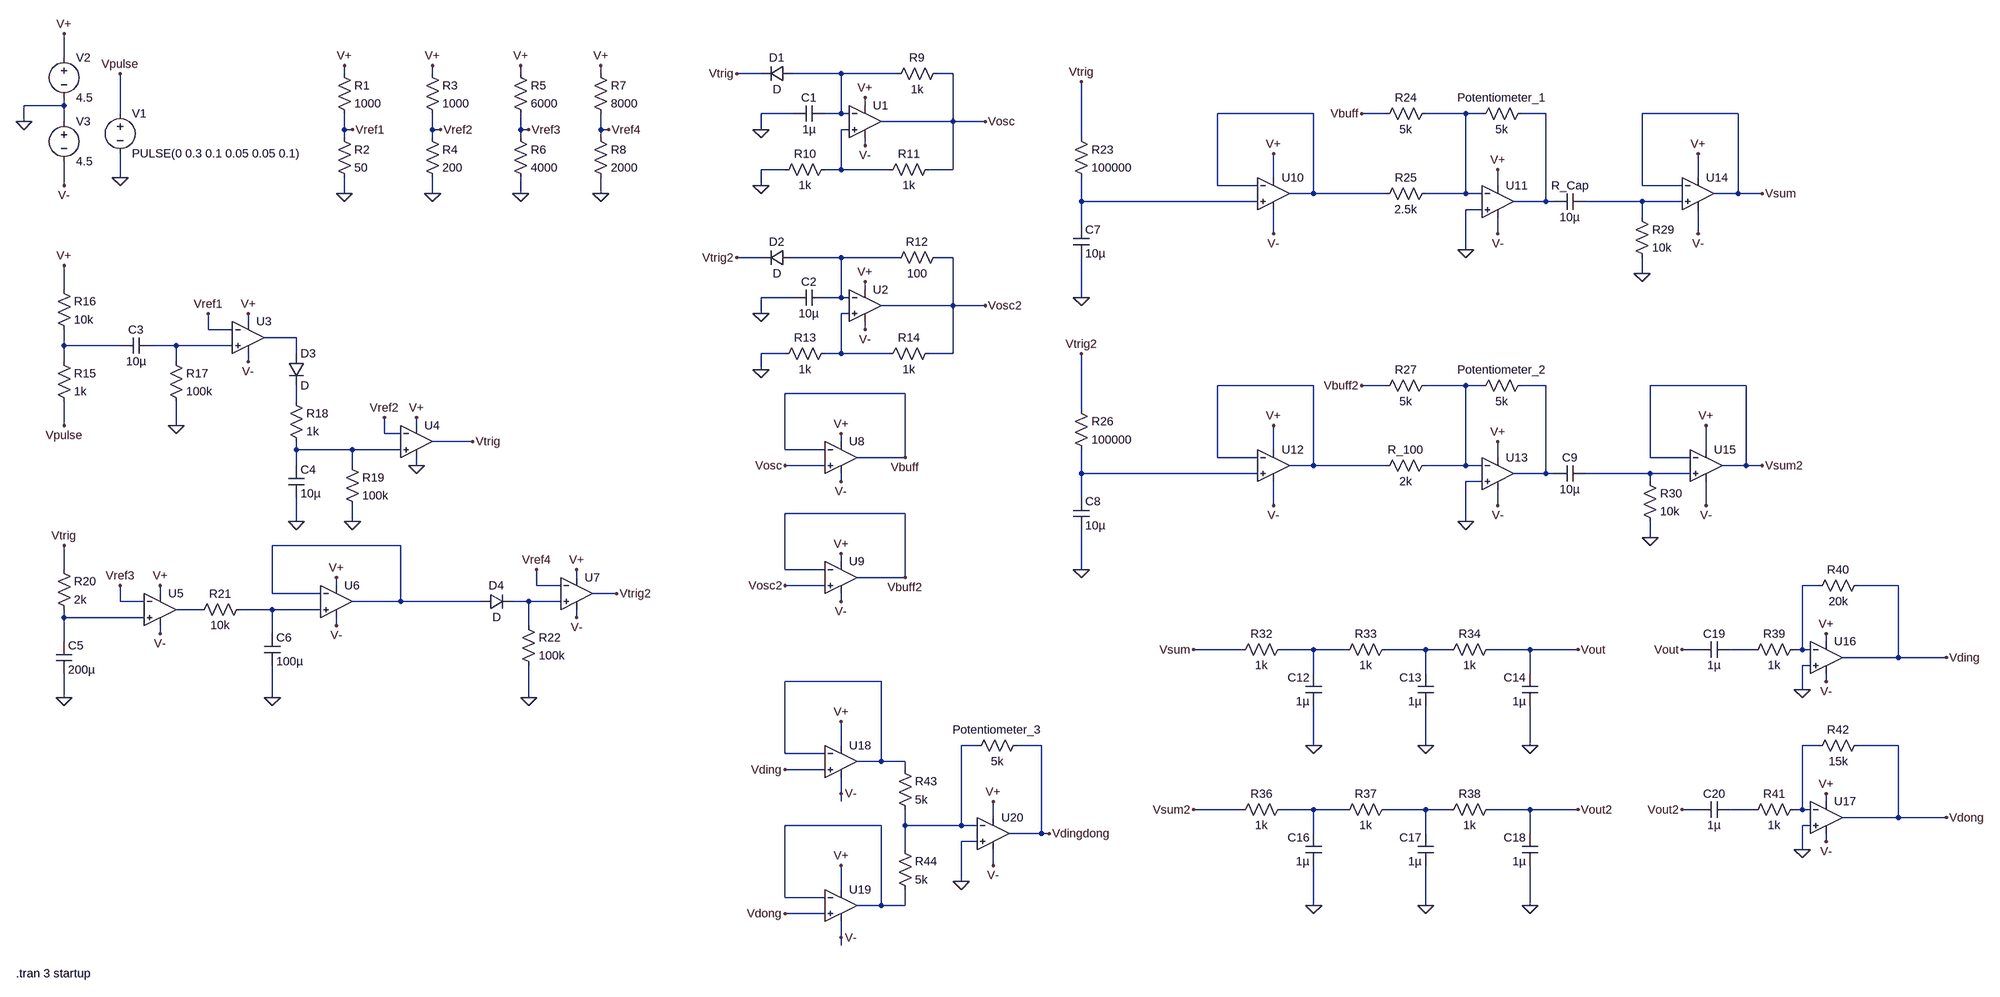
[diagram p0: schematic Project 3 2001.asc]
Project 3 2001.asc, the LTspice schematic file:
Version 4
SHEET 1 3848 1864
WIRE -352 16 -352 -32
WIRE 208 48 208 32
WIRE 384 48 384 32
WIRE 560 48 560 32
WIRE 720 48 720 32
WIRE 1360 48 1312 48
WIRE 1520 48 1424 48
WIRE 1632 48 1520 48
WIRE 1744 48 1712 48
WIRE -352 112 -352 96
WIRE -352 112 -432 112
WIRE 1568 112 1568 96
WIRE -240 128 -240 48
WIRE 1424 128 1360 128
WIRE 1520 128 1520 48
WIRE 1520 128 1488 128
WIRE 1536 128 1520 128
WIRE 2464 128 2272 128
WIRE 2608 128 2560 128
WIRE 2768 128 2688 128
WIRE 2800 128 2768 128
WIRE 2928 128 2880 128
WIRE 3312 128 3120 128
WIRE -432 144 -432 112
WIRE -352 144 -352 112
WIRE 1744 144 1744 48
WIRE 1744 144 1600 144
WIRE 1808 144 1744 144
WIRE 208 160 208 128
WIRE 224 160 208 160
WIRE 384 160 384 128
WIRE 400 160 384 160
WIRE 560 160 560 128
WIRE 576 160 560 160
WIRE 720 160 720 128
WIRE 736 160 720 160
WIRE 1360 160 1360 128
WIRE 1536 160 1520 160
WIRE 208 176 208 160
WIRE 384 176 384 160
WIRE 560 176 560 160
WIRE 720 176 720 160
WIRE 2000 176 2000 64
WIRE 1568 192 1568 176
WIRE 1408 240 1360 240
WIRE 1520 240 1520 160
WIRE 1520 240 1488 240
WIRE 1616 240 1520 240
WIRE 1744 240 1744 144
WIRE 1744 240 1696 240
WIRE -240 256 -240 208
WIRE 2384 256 2384 208
WIRE 3232 256 3232 208
WIRE -352 272 -352 224
WIRE 1360 272 1360 240
WIRE 2272 272 2272 128
WIRE 2352 272 2272 272
WIRE 2832 272 2832 240
WIRE 3120 272 3120 128
WIRE 3200 272 3120 272
WIRE 208 288 208 256
WIRE 384 288 384 256
WIRE 560 288 560 256
WIRE 720 288 720 256
WIRE 2464 288 2464 128
WIRE 2464 288 2416 288
WIRE 2608 288 2464 288
WIRE 2768 288 2768 128
WIRE 2768 288 2688 288
WIRE 2800 288 2768 288
WIRE 3312 288 3312 128
WIRE 3312 288 3264 288
WIRE 3360 288 3312 288
WIRE 2000 304 2000 256
WIRE 2352 304 2000 304
WIRE 2928 304 2928 128
WIRE 2928 304 2864 304
WIRE 2944 304 2928 304
WIRE 3120 304 3008 304
WIRE 3200 304 3120 304
WIRE 2800 320 2768 320
WIRE 3120 336 3120 304
WIRE 2000 352 2000 304
WIRE 2384 368 2384 320
WIRE 2832 368 2832 336
WIRE 3232 368 3232 320
WIRE 2768 400 2768 320
WIRE 1360 416 1312 416
WIRE 1520 416 1424 416
WIRE 1632 416 1520 416
WIRE 1744 416 1712 416
WIRE 3120 448 3120 416
WIRE -352 480 -352 432
WIRE 1568 480 1568 464
WIRE 1424 496 1360 496
WIRE 1520 496 1520 416
WIRE 1520 496 1488 496
WIRE 1536 496 1520 496
WIRE 2000 496 2000 416
WIRE 1744 512 1744 416
WIRE 1744 512 1600 512
WIRE 1808 512 1744 512
WIRE 1360 528 1360 496
WIRE 1536 528 1520 528
WIRE 16 544 16 528
WIRE -64 560 -64 528
WIRE -16 560 -64 560
WIRE 1568 560 1568 544
WIRE 112 576 48 576
WIRE -352 592 -352 560
WIRE -240 592 -352 592
WIRE -128 592 -176 592
WIRE -16 592 -128 592
WIRE 112 608 112 576
WIRE 1408 608 1360 608
WIRE 1520 608 1520 528
WIRE 1520 608 1488 608
WIRE 1616 608 1520 608
WIRE 1744 608 1744 512
WIRE 1744 608 1696 608
WIRE -352 624 -352 592
WIRE -128 624 -128 592
WIRE 16 624 16 608
WIRE 1360 640 1360 608
WIRE 2464 672 2272 672
WIRE 2608 672 2560 672
WIRE 2768 672 2688 672
WIRE 2800 672 2768 672
WIRE 2928 672 2880 672
WIRE 3328 672 3136 672
WIRE 1648 688 1408 688
WIRE 112 704 112 672
WIRE 2000 720 2000 608
WIRE -352 752 -352 704
WIRE -128 752 -128 704
WIRE 352 752 352 736
WIRE 288 768 288 736
WIRE 320 768 288 768
WIRE 464 784 384 784
WIRE 1520 784 1520 768
WIRE 112 800 112 784
WIRE 224 800 112 800
WIRE 320 800 224 800
WIRE 1408 800 1408 688
WIRE 1488 800 1408 800
WIRE 2384 800 2384 752
WIRE 3248 800 3248 752
WIRE 1648 816 1648 688
WIRE 1648 816 1552 816
WIRE 2272 816 2272 672
WIRE 2352 816 2272 816
WIRE 2832 816 2832 784
WIRE 3136 816 3136 672
WIRE 3216 816 3136 816
WIRE 112 832 112 800
WIRE 224 832 224 800
WIRE 352 832 352 816
WIRE 1488 832 1408 832
WIRE 2464 832 2464 672
WIRE 2464 832 2416 832
WIRE 2608 832 2464 832
WIRE 2768 832 2768 672
WIRE 2768 832 2688 832
WIRE 2800 832 2768 832
WIRE 3328 832 3328 672
WIRE 3328 832 3280 832
WIRE 3360 832 3328 832
WIRE 2000 848 2000 800
WIRE 2352 848 2000 848
WIRE 2928 848 2928 672
WIRE 2928 848 2864 848
WIRE 2944 848 2928 848
WIRE 3136 848 3008 848
WIRE 3216 848 3136 848
WIRE 1520 864 1520 848
WIRE 2800 864 2768 864
WIRE 3136 864 3136 848
WIRE 2000 896 2000 848
WIRE 2384 912 2384 864
WIRE 2832 912 2832 880
WIRE 3248 912 3248 864
WIRE 1648 928 1408 928
WIRE 112 944 112 896
WIRE 224 944 224 912
WIRE 2768 944 2768 864
WIRE 3136 976 3136 944
WIRE 320 992 64 992
WIRE 1520 1024 1520 1008
WIRE -352 1040 -352 992
WIRE 1408 1040 1408 928
WIRE 1488 1040 1408 1040
WIRE 2000 1040 2000 960
WIRE 672 1056 672 1040
WIRE 1648 1056 1648 928
WIRE 1648 1056 1552 1056
WIRE 192 1072 192 1056
WIRE 592 1072 592 1040
WIRE 640 1072 592 1072
WIRE 1488 1072 1408 1072
WIRE 3472 1072 3440 1072
WIRE 3632 1072 3552 1072
WIRE -160 1088 -160 1072
WIRE 64 1088 64 992
WIRE 160 1088 64 1088
WIRE 752 1088 704 1088
WIRE -240 1104 -240 1072
WIRE -192 1104 -240 1104
WIRE 320 1104 320 992
WIRE 320 1104 224 1104
WIRE 480 1104 320 1104
WIRE 576 1104 544 1104
WIRE 640 1104 576 1104
WIRE 1520 1104 1520 1088
WIRE -80 1120 -128 1120
WIRE 64 1120 0 1120
WIRE 160 1120 64 1120
WIRE -352 1136 -352 1120
WIRE -192 1136 -352 1136
WIRE 672 1136 672 1120
WIRE 192 1152 192 1136
WIRE 576 1152 576 1104
WIRE -160 1168 -160 1152
WIRE 64 1168 64 1120
WIRE -352 1184 -352 1136
WIRE 3488 1184 3488 1168
WIRE 2320 1200 2224 1200
WIRE 2464 1200 2400 1200
WIRE 2528 1200 2464 1200
WIRE 2688 1200 2608 1200
WIRE 2736 1200 2688 1200
WIRE 2896 1200 2816 1200
WIRE 2992 1200 2896 1200
WIRE 3232 1200 3200 1200
WIRE 3344 1200 3296 1200
WIRE 3440 1200 3440 1072
WIRE 3440 1200 3424 1200
WIRE 3456 1200 3440 1200
WIRE 3632 1216 3632 1072
WIRE 3632 1216 3520 1216
WIRE 3728 1216 3632 1216
WIRE 3456 1232 3440 1232
WIRE 2464 1248 2464 1200
WIRE 2688 1248 2688 1200
WIRE 2896 1248 2896 1200
WIRE 1600 1264 1408 1264
WIRE 3488 1264 3488 1248
WIRE 3440 1280 3440 1232
WIRE -352 1296 -352 1248
WIRE 64 1296 64 1232
WIRE 576 1296 576 1232
WIRE 1520 1392 1520 1344
WIRE 1792 1392 1760 1392
WIRE 1920 1392 1872 1392
WIRE 2464 1392 2464 1312
WIRE 2688 1392 2688 1312
WIRE 2896 1392 2896 1312
WIRE 3472 1392 3440 1392
WIRE 3632 1392 3552 1392
WIRE 1408 1408 1408 1264
WIRE 1488 1408 1408 1408
WIRE 1600 1424 1600 1264
WIRE 1600 1424 1552 1424
WIRE 1648 1424 1600 1424
WIRE 1488 1440 1408 1440
WIRE 1648 1440 1648 1424
WIRE 1520 1488 1520 1456
WIRE 1520 1504 1520 1488
WIRE 3488 1504 3488 1488
WIRE 2320 1520 2224 1520
WIRE 2464 1520 2400 1520
WIRE 2528 1520 2464 1520
WIRE 2688 1520 2608 1520
WIRE 2736 1520 2688 1520
WIRE 2896 1520 2816 1520
WIRE 2992 1520 2896 1520
WIRE 3232 1520 3200 1520
WIRE 3344 1520 3296 1520
WIRE 3440 1520 3440 1392
WIRE 3440 1520 3424 1520
WIRE 3456 1520 3440 1520
WIRE 1824 1536 1824 1504
WIRE 3632 1536 3632 1392
WIRE 3632 1536 3520 1536
WIRE 3728 1536 3632 1536
WIRE 1600 1552 1408 1552
WIRE 1648 1552 1648 1520
WIRE 1760 1552 1760 1392
WIRE 1760 1552 1648 1552
WIRE 1792 1552 1760 1552
WIRE 3456 1552 3440 1552
WIRE 1920 1568 1920 1392
WIRE 1920 1568 1856 1568
WIRE 1936 1568 1920 1568
WIRE 2464 1568 2464 1520
WIRE 2688 1568 2688 1520
WIRE 2896 1568 2896 1520
WIRE 1792 1584 1760 1584
WIRE 3488 1584 3488 1568
WIRE 1648 1600 1648 1552
WIRE 3440 1600 3440 1552
WIRE 1824 1632 1824 1600
WIRE 1760 1664 1760 1584
WIRE 1520 1680 1520 1632
WIRE 1408 1696 1408 1552
WIRE 1488 1696 1408 1696
WIRE 1600 1712 1600 1552
WIRE 1600 1712 1552 1712
WIRE 1648 1712 1648 1680
WIRE 1648 1712 1600 1712
WIRE 2464 1712 2464 1632
WIRE 2688 1712 2688 1632
WIRE 2896 1712 2896 1632
WIRE 1488 1728 1408 1728
WIRE 1520 1776 1520 1744
WIRE 1520 1792 1520 1776
FLAG -240 256 0
FLAG -240 48 Vpulse
FLAG -432 144 0
FLAG -352 -32 V+
FLAG -352 272 V-
FLAG 208 288 0
FLAG 384 288 0
FLAG 560 288 0
FLAG 720 288 0
FLAG 224 160 Vref1
FLAG 400 160 Vref2
FLAG 576 160 Vref3
FLAG 736 160 Vref4
FLAG 208 32 V+
FLAG 384 32 V+
FLAG 560 32 V+
FLAG 720 32 V+
FLAG 1360 160 0
FLAG 1360 272 0
FLAG 1568 96 V+
FLAG 1568 192 V-
FLAG 1312 48 Vtrig
FLAG 1808 144 Vosc
FLAG 1360 528 0
FLAG 1360 640 0
FLAG 1568 464 V+
FLAG 1568 560 V-
FLAG 1312 416 Vtrig2
FLAG 1808 512 Vosc2
FLAG -352 432 V+
FLAG -352 752 Vpulse
FLAG -128 752 0
FLAG -64 528 Vref1
FLAG 16 528 V+
FLAG 16 624 V-
FLAG 112 944 0
FLAG 224 944 0
FLAG 288 736 Vref2
FLAG 352 736 V+
FLAG 464 784 Vtrig
FLAG -352 1296 0
FLAG -352 992 Vtrig
FLAG -240 1072 Vref3
FLAG -160 1072 V+
FLAG -160 1168 V-
FLAG 64 1296 0
FLAG 192 1056 V+
FLAG 192 1152 V-
FLAG 592 1040 Vref4
FLAG 672 1040 V+
FLAG 672 1136 V-
FLAG 576 1296 0
FLAG 752 1088 Vtrig2
FLAG 1520 768 V+
FLAG 1520 864 V-
FLAG 1520 1008 V+
FLAG 1520 1104 V-
FLAG 1408 1072 Vosc2
FLAG 1408 832 Vosc
FLAG 1648 816 Vbuff
FLAG 1648 1056 Vbuff2
FLAG 2000 496 0
FLAG 2384 208 V+
FLAG 2384 368 V-
FLAG 2768 400 0
FLAG 2832 240 V+
FLAG 2832 368 V-
FLAG 3360 288 Vsum
FLAG 2560 128 Vbuff
FLAG 2000 64 Vtrig
FLAG 2000 1040 0
FLAG 2384 752 V+
FLAG 2384 912 V-
FLAG 2768 944 0
FLAG 2832 784 V+
FLAG 2832 912 V-
FLAG 3360 832 Vsum2
FLAG 2560 672 Vbuff2
FLAG 2000 608 Vtrig2
FLAG 3120 448 0
FLAG 3136 976 0
FLAG 3232 208 V+
FLAG 3232 368 V-
FLAG 3248 752 V+
FLAG 3248 912 V-
FLAG 2464 1392 0
FLAG 2688 1392 0
FLAG 2896 1392 0
FLAG 2224 1200 Vsum
FLAG 2992 1200 Vout
FLAG 2464 1712 0
FLAG 2688 1712 0
FLAG 2896 1712 0
FLAG 2224 1520 Vsum2
FLAG 2992 1520 Vout2
FLAG 3488 1168 V+
FLAG 3488 1264 V-
FLAG 3440 1280 0
FLAG 3488 1488 V+
FLAG 3488 1584 V-
FLAG 3440 1600 0
FLAG 3200 1200 Vout
FLAG 3200 1520 Vout2
FLAG 3728 1216 Vding
FLAG 3728 1536 Vdong
FLAG 1520 1344 V+
FLAG 1520 1488 V-
FLAG 1520 1632 V+
FLAG 1520 1776 V-
FLAG 1936 1568 Vdingdong
FLAG 1408 1440 Vding
FLAG 1408 1728 Vdong
FLAG 352 832 0
FLAG 1760 1664 0
FLAG 1824 1504 V+
FLAG 1824 1632 V-
SYMBOL voltage -240 112 R0
WINDOW 123 0 0 Left 0
WINDOW 39 0 0 Left 0
SYMATTR InstName V1
SYMATTR Value PULSE(0 0.3 0.1 0.05 0.05 0.1)
SYMBOL voltage -352 0 R0
WINDOW 123 0 0 Left 0
WINDOW 39 0 0 Left 0
SYMATTR InstName V2
SYMATTR Value 4.5
SYMBOL voltage -352 128 R0
WINDOW 123 0 0 Left 0
WINDOW 39 0 0 Left 0
SYMATTR InstName V3
SYMATTR Value 4.5
SYMBOL res 192 32 R0
SYMATTR InstName R1
SYMATTR Value 1000
SYMBOL res 192 160 R0
SYMATTR InstName R2
SYMATTR Value 50
SYMBOL res 368 32 R0
SYMATTR InstName R3
SYMATTR Value 1000
SYMBOL res 368 160 R0
SYMATTR InstName R4
SYMATTR Value 200
SYMBOL res 544 32 R0
SYMATTR InstName R5
SYMATTR Value 6000
SYMBOL res 544 160 R0
SYMATTR InstName R6
SYMATTR Value 4000
SYMBOL res 704 32 R0
SYMATTR InstName R7
SYMATTR Value 8000
SYMBOL res 704 160 R0
SYMATTR InstName R8
SYMATTR Value 2000
SYMBOL res 1728 32 R90
WINDOW 0 0 56 VBottom 2
WINDOW 3 32 56 VTop 2
SYMATTR InstName R9
SYMATTR Value 1k
SYMBOL res 1504 224 R90
WINDOW 0 0 56 VBottom 2
WINDOW 3 32 56 VTop 2
SYMATTR InstName R10
SYMATTR Value 1k
SYMBOL res 1712 224 R90
WINDOW 0 0 56 VBottom 2
WINDOW 3 32 56 VTop 2
SYMATTR InstName R11
SYMATTR Value 1k
SYMBOL OpAmps\\UniversalOpAmp2 1568 144 R0
SYMATTR InstName U1
SYMBOL cap 1488 112 R90
WINDOW 0 0 32 VBottom 2
WINDOW 3 32 32 VTop 2
SYMATTR InstName C1
SYMATTR Value 1µ
SYMBOL diode 1424 32 R90
WINDOW 0 0 32 VBottom 2
WINDOW 3 32 32 VTop 2
SYMATTR InstName D1
SYMBOL res 1728 400 R90
WINDOW 0 0 56 VBottom 2
WINDOW 3 32 56 VTop 2
SYMATTR InstName R12
SYMATTR Value 100
SYMBOL res 1504 592 R90
WINDOW 0 0 56 VBottom 2
WINDOW 3 32 56 VTop 2
SYMATTR InstName R13
SYMATTR Value 1k
SYMBOL res 1712 592 R90
WINDOW 0 0 56 VBottom 2
WINDOW 3 32 56 VTop 2
SYMATTR InstName R14
SYMATTR Value 1k
SYMBOL OpAmps\\UniversalOpAmp2 1568 512 R0
SYMATTR InstName U2
SYMBOL cap 1488 480 R90
WINDOW 0 0 32 VBottom 2
WINDOW 3 32 32 VTop 2
SYMATTR InstName C2
SYMATTR Value 10µ
SYMBOL diode 1424 400 R90
WINDOW 0 0 32 VBottom 2
WINDOW 3 32 32 VTop 2
SYMATTR InstName D2
SYMBOL res -368 608 R0
SYMATTR InstName R15
SYMATTR Value 1k
SYMBOL res -368 464 R0
SYMATTR InstName R16
SYMATTR Value 10k
SYMBOL cap -176 576 R90
WINDOW 0 0 32 VBottom 2
WINDOW 3 32 32 VTop 2
SYMATTR InstName C3
SYMATTR Value 10µ
SYMBOL res -144 608 R0
SYMATTR InstName R17
SYMATTR Value 100k
SYMBOL OpAmps\\UniversalOpAmp2 16 576 R0
SYMATTR InstName U3
SYMBOL diode 96 608 R0
SYMATTR InstName D3
SYMBOL res 96 688 R0
SYMATTR InstName R18
SYMATTR Value 1k
SYMBOL cap 96 832 R0
SYMATTR InstName C4
SYMATTR Value 10µ
SYMBOL res 208 816 R0
SYMATTR InstName R19
SYMATTR Value 100k
SYMBOL OpAmps\\UniversalOpAmp2 352 784 R0
SYMATTR InstName U4
SYMBOL res -368 1024 R0
SYMATTR InstName R20
SYMATTR Value 2k
SYMBOL cap -368 1184 R0
SYMATTR InstName C5
SYMATTR Value 200µ
SYMBOL OpAmps\\UniversalOpAmp2 -160 1120 R0
SYMATTR InstName U5
SYMBOL res 16 1104 R90
WINDOW 0 0 56 VBottom 2
WINDOW 3 32 56 VTop 2
SYMATTR InstName R21
SYMATTR Value 10k
SYMBOL cap 48 1168 R0
SYMATTR InstName C6
SYMATTR Value 100µ
SYMBOL OpAmps\\UniversalOpAmp2 192 1104 R0
SYMATTR InstName U6
SYMBOL diode 480 1120 R270
WINDOW 0 32 32 VTop 2
WINDOW 3 0 32 VBottom 2
SYMATTR InstName D4
SYMBOL OpAmps\\UniversalOpAmp2 672 1088 R0
SYMATTR InstName U7
SYMBOL res 560 1136 R0
SYMATTR InstName R22
SYMATTR Value 100k
SYMBOL OpAmps\\UniversalOpAmp2 1520 816 R0
SYMATTR InstName U8
SYMBOL OpAmps\\UniversalOpAmp2 1520 1056 R0
SYMATTR InstName U9
SYMBOL res 1984 160 R0
SYMATTR InstName R23
SYMATTR Value 100000
SYMBOL cap 1984 352 R0
SYMATTR InstName C7
SYMATTR Value 10µ
SYMBOL OpAmps\\UniversalOpAmp2 2384 288 R0
SYMATTR InstName U10
SYMBOL OpAmps\\UniversalOpAmp2 2832 304 R0
SYMATTR InstName U11
SYMBOL res 2704 112 R90
WINDOW 0 0 56 VBottom 2
WINDOW 3 32 56 VTop 2
SYMATTR InstName R24
SYMATTR Value 5k
SYMBOL res 2704 272 R90
WINDOW 0 0 56 VBottom 2
WINDOW 3 32 56 VTop 2
SYMATTR InstName R25
SYMATTR Value 2.5k
SYMBOL res 2896 112 R90
WINDOW 0 0 56 VBottom 2
WINDOW 3 32 56 VTop 2
SYMATTR InstName Potentiometer_1
SYMATTR Value 5k
SYMBOL res 1984 704 R0
SYMATTR InstName R26
SYMATTR Value 100000
SYMBOL cap 1984 896 R0
SYMATTR InstName C8
SYMATTR Value 10µ
SYMBOL OpAmps\\UniversalOpAmp2 2384 832 R0
SYMATTR InstName U12
SYMBOL OpAmps\\UniversalOpAmp2 2832 848 R0
SYMATTR InstName U13
SYMBOL res 2704 656 R90
WINDOW 0 0 56 VBottom 2
WINDOW 3 32 56 VTop 2
SYMATTR InstName R27
SYMATTR Value 5k
SYMBOL res 2704 816 R90
WINDOW 0 0 56 VBottom 2
WINDOW 3 32 56 VTop 2
SYMATTR InstName R_100
SYMATTR Value 2k
SYMBOL res 2896 656 R90
WINDOW 0 0 56 VBottom 2
WINDOW 3 32 56 VTop 2
SYMATTR InstName Potentiometer_2
SYMATTR Value 5k
SYMBOL cap 3008 832 R90
WINDOW 0 0 32 VBottom 2
WINDOW 3 32 32 VTop 2
SYMATTR InstName C9
SYMATTR Value 10µ
SYMBOL cap 3008 288 R90
WINDOW 0 0 32 VBottom 2
WINDOW 3 32 32 VTop 2
SYMATTR InstName R_Cap
SYMATTR Value 10µ
SYMBOL res 3104 320 R0
SYMATTR InstName R29
SYMATTR Value 10k
SYMBOL res 3120 848 R0
SYMATTR InstName R30
SYMATTR Value 10k
SYMBOL OpAmps\\UniversalOpAmp2 3232 288 R0
SYMATTR InstName U14
SYMBOL OpAmps\\UniversalOpAmp2 3248 832 R0
SYMATTR InstName U15
SYMBOL cap 2480 1312 R180
WINDOW 0 24 56 Left 2
WINDOW 3 24 8 Left 2
SYMATTR InstName C12
SYMATTR Value 1µ
SYMBOL cap 2704 1312 R180
WINDOW 0 24 56 Left 2
WINDOW 3 24 8 Left 2
SYMATTR InstName C13
SYMATTR Value 1µ
SYMBOL cap 2912 1312 R180
WINDOW 0 24 56 Left 2
WINDOW 3 24 8 Left 2
SYMATTR InstName C14
SYMATTR Value 1µ
SYMBOL res 2416 1184 R90
WINDOW 0 0 56 VBottom 2
WINDOW 3 32 56 VTop 2
SYMATTR InstName R32
SYMATTR Value 1k
SYMBOL res 2624 1184 R90
WINDOW 0 0 56 VBottom 2
WINDOW 3 32 56 VTop 2
SYMATTR InstName R33
SYMATTR Value 1k
SYMBOL res 2832 1184 R90
WINDOW 0 0 56 VBottom 2
WINDOW 3 32 56 VTop 2
SYMATTR InstName R34
SYMATTR Value 1k
SYMBOL cap 2480 1632 R180
WINDOW 0 24 56 Left 2
WINDOW 3 24 8 Left 2
SYMATTR InstName C16
SYMATTR Value 1µ
SYMBOL cap 2704 1632 R180
WINDOW 0 24 56 Left 2
WINDOW 3 24 8 Left 2
SYMATTR InstName C17
SYMATTR Value 1µ
SYMBOL cap 2912 1632 R180
WINDOW 0 24 56 Left 2
WINDOW 3 24 8 Left 2
SYMATTR InstName C18
SYMATTR Value 1µ
SYMBOL res 2416 1504 R90
WINDOW 0 0 56 VBottom 2
WINDOW 3 32 56 VTop 2
SYMATTR InstName R36
SYMATTR Value 1k
SYMBOL res 2624 1504 R90
WINDOW 0 0 56 VBottom 2
WINDOW 3 32 56 VTop 2
SYMATTR InstName R37
SYMATTR Value 1k
SYMBOL res 2832 1504 R90
WINDOW 0 0 56 VBottom 2
WINDOW 3 32 56 VTop 2
SYMATTR InstName R38
SYMATTR Value 1k
SYMBOL res 3440 1184 R90
WINDOW 0 0 56 VBottom 2
WINDOW 3 32 56 VTop 2
SYMATTR InstName R39
SYMATTR Value 1k
SYMBOL res 3568 1056 R90
WINDOW 0 0 56 VBottom 2
WINDOW 3 32 56 VTop 2
SYMATTR InstName R40
SYMATTR Value 20k
SYMBOL cap 3296 1184 R90
WINDOW 0 0 32 VBottom 2
WINDOW 3 32 32 VTop 2
SYMATTR InstName C19
SYMATTR Value 1µ
SYMBOL OpAmps\\UniversalOpAmp2 3488 1216 R0
SYMATTR InstName U16
SYMBOL res 3440 1504 R90
WINDOW 0 0 56 VBottom 2
WINDOW 3 32 56 VTop 2
SYMATTR InstName R41
SYMATTR Value 1k
SYMBOL res 3568 1376 R90
WINDOW 0 0 56 VBottom 2
WINDOW 3 32 56 VTop 2
SYMATTR InstName R42
SYMATTR Value 15k
SYMBOL cap 3296 1504 R90
WINDOW 0 0 32 VBottom 2
WINDOW 3 32 32 VTop 2
SYMATTR InstName C20
SYMATTR Value 1µ
SYMBOL OpAmps\\UniversalOpAmp2 3488 1536 R0
SYMATTR InstName U17
SYMBOL OpAmps\\UniversalOpAmp2 1520 1424 R0
SYMATTR InstName U18
SYMBOL OpAmps\\UniversalOpAmp2 1520 1712 R0
SYMATTR InstName U19
SYMBOL res 1632 1424 R0
SYMATTR InstName R43
SYMATTR Value 5k
SYMBOL res 1632 1584 R0
SYMATTR InstName R44
SYMATTR Value 5k
SYMBOL OpAmps\\UniversalOpAmp2 1824 1568 R0
SYMATTR InstName U20
SYMBOL res 1888 1376 R90
WINDOW 0 0 56 VBottom 2
WINDOW 3 32 56 VTop 2
SYMATTR InstName Potentiometer_3
SYMATTR Value 5k
TEXT -448 1848 Left 2 !.tran 3 startup

The netlist it stands for:
* Project 3 2001.asc
V1 Vpulse 0 PULSE(0 0.3 0.1 0.05 0.05 0.1)
V2 V+ 0 4.5
V3 0 V- 4.5
R1 V+ Vref1 1000
R2 Vref1 0 50
R3 V+ Vref2 1000
R4 Vref2 0 200
R5 V+ Vref3 6000
R6 Vref3 0 4000
R7 V+ Vref4 8000
R8 Vref4 0 2000
R9 Vosc N001 1k
R10 N005 0 1k
R11 Vosc N005 1k
XU1 N005 N001 V+ V- Vosc level2 Avol=1Meg GBW=10Meg Slew=10Meg Ilimit=25m Rail=0 Vos=0 En=0 Enk=0 In=0 Ink=0 Rin=500Meg  ; pins In+ In- V+ V- OUT
C1 N001 0 1µ
D1 N001 Vtrig D
R12 Vosc2 N008 100
R13 N009 0 1k
R14 Vosc2 N009 1k
XU2 N009 N008 V+ V- Vosc2 level2 Avol=1Meg GBW=10Meg Slew=10Meg Ilimit=25m Rail=0 Vos=0 En=0 Enk=0 In=0 Ink=0 Rin=500Meg  ; pins In+ In- V+ V- OUT
C2 N008 0 10µ
D2 N008 Vtrig2 D
R15 N011 Vpulse 1k
R16 V+ N011 10k
C3 N012 N011 10µ
R17 N012 0 100k
XU3 N012 Vref1 V+ V- N010 level2 Avol=1Meg GBW=10Meg Slew=10Meg Ilimit=25m Rail=0 Vos=0 En=0 Enk=0 In=0 Ink=0 Rin=500Meg  ; pins In+ In- V+ V- OUT
D3 N010 N016 D
R18 N016 N017 1k
C4 N017 0 10µ
R19 N017 0 100k
XU4 N017 Vref2 V+ 0 Vtrig level2 Avol=1Meg GBW=10Meg Slew=10Meg Ilimit=25m Rail=0 Vos=0 En=0 Enk=0 In=0 Ink=0 Rin=500Meg  ; pins In+ In- V+ V- OUT
R20 Vtrig N025 2k
C5 N025 0 200µ
XU5 N025 Vref3 V+ V- N023 level2 Avol=1Meg GBW=10Meg Slew=10Meg Ilimit=25m Rail=0 Vos=0 En=0 Enk=0 In=0 Ink=0 Rin=500Meg  ; pins In+ In- V+ V- OUT
R21 N024 N023 10k
C6 N024 0 100µ
XU6 N024 N020 V+ V- N020 level2 Avol=1Meg GBW=10Meg Slew=10Meg Ilimit=25m Rail=0 Vos=0 En=0 Enk=0 In=0 Ink=0 Rin=500Meg  ; pins In+ In- V+ V- OUT
D4 N020 N022 D
XU7 N022 Vref4 V+ V- Vtrig2 level2 Avol=1Meg GBW=10Meg Slew=10Meg Ilimit=25m Rail=0 Vos=0 En=0 Enk=0 In=0 Ink=0 Rin=500Meg  ; pins In+ In- V+ V- OUT
R22 N022 0 100k
XU8 Vosc Vbuff V+ V- Vbuff level2 Avol=1Meg GBW=10Meg Slew=10Meg Ilimit=25m Rail=0 Vos=0 En=0 Enk=0 In=0 Ink=0 Rin=500Meg  ; pins In+ In- V+ V- OUT
XU9 Vosc2 Vbuff2 V+ V- Vbuff2 level2 Avol=1Meg GBW=10Meg Slew=10Meg Ilimit=25m Rail=0 Vos=0 En=0 Enk=0 In=0 Ink=0 Rin=500Meg  ; pins In+ In- V+ V- OUT
R23 Vtrig N006 100000
C7 N006 0 10µ
XU10 N006 N002 V+ V- N002 level2 Avol=1Meg GBW=10Meg Slew=10Meg Ilimit=25m Rail=0 Vos=0 En=0 Enk=0 In=0 Ink=0 Rin=500Meg  ; pins In+ In- V+ V- OUT
XU11 0 N003 V+ V- N004 level2 Avol=1Meg GBW=10Meg Slew=10Meg Ilimit=25m Rail=0 Vos=0 En=0 Enk=0 In=0 Ink=0 Rin=500Meg  ; pins In+ In- V+ V- OUT
R24 N003 Vbuff 5k
R25 N003 N002 2.5k
R§Potentiometer_1 N004 N003 5k
R26 Vtrig2 N018 100000
C8 N018 0 10µ
XU12 N018 N013 V+ V- N013 level2 Avol=1Meg GBW=10Meg Slew=10Meg Ilimit=25m Rail=0 Vos=0 En=0 Enk=0 In=0 Ink=0 Rin=500Meg  ; pins In+ In- V+ V- OUT
XU13 0 N014 V+ V- N015 level2 Avol=1Meg GBW=10Meg Slew=10Meg Ilimit=25m Rail=0 Vos=0 En=0 Enk=0 In=0 Ink=0 Rin=500Meg  ; pins In+ In- V+ V- OUT
R27 N014 Vbuff2 5k
R_100 N014 N013 2k
R§Potentiometer_2 N015 N014 5k
C9 N019 N015 10µ
C§R_Cap N007 N004 10µ
R29 N007 0 10k
R30 N019 0 10k
XU14 N007 Vsum V+ V- Vsum level2 Avol=1Meg GBW=10Meg Slew=10Meg Ilimit=25m Rail=0 Vos=0 En=0 Enk=0 In=0 Ink=0 Rin=500Meg  ; pins In+ In- V+ V- OUT
XU15 N019 Vsum2 V+ V- Vsum2 level2 Avol=1Meg GBW=10Meg Slew=10Meg Ilimit=25m Rail=0 Vos=0 En=0 Enk=0 In=0 Ink=0 Rin=500Meg  ; pins In+ In- V+ V- OUT
C12 0 N026 1µ
C13 0 N027 1µ
C14 0 Vout 1µ
R32 N026 Vsum 1k
R33 N027 N026 1k
R34 Vout N027 1k
C16 0 N032 1µ
C17 0 N033 1µ
C18 0 Vout2 1µ
R36 N032 Vsum2 1k
R37 N033 N032 1k
R38 Vout2 N033 1k
R39 N021 N028 1k
R40 Vding N021 20k
C19 N028 Vout 1µ
XU16 0 N021 V+ V- Vding level2 Avol=1Meg GBW=10Meg Slew=10Meg Ilimit=25m Rail=0 Vos=0 En=0 Enk=0 In=0 Ink=0 Rin=500Meg  ; pins In+ In- V+ V- OUT
R41 N031 N034 1k
R42 Vdong N031 15k
C20 N034 Vout2 1µ
XU17 0 N031 V+ V- Vdong level2 Avol=1Meg GBW=10Meg Slew=10Meg Ilimit=25m Rail=0 Vos=0 En=0 Enk=0 In=0 Ink=0 Rin=500Meg  ; pins In+ In- V+ V- OUT
XU18 Vding N029 V+ V- N029 level2 Avol=1Meg GBW=10Meg Slew=10Meg Ilimit=25m Rail=0 Vos=0 En=0 Enk=0 In=0 Ink=0 Rin=500Meg  ; pins In+ In- V+ V- OUT
XU19 Vdong N035 V+ V- N035 level2 Avol=1Meg GBW=10Meg Slew=10Meg Ilimit=25m Rail=0 Vos=0 En=0 Enk=0 In=0 Ink=0 Rin=500Meg  ; pins In+ In- V+ V- OUT
R43 N029 N030 5k
R44 N030 N035 5k
XU20 0 N030 V+ V- Vdingdong level2 Avol=1Meg GBW=10Meg Slew=10Meg Ilimit=25m Rail=0 Vos=0 En=0 Enk=0 In=0 Ink=0 Rin=500Meg  ; pins In+ In- V+ V- OUT
R§Potentiometer_3 Vdingdong N030 5k
.model D D
.lib standard.dio
.tran 3 startup
.lib UniversalOpAmp2.lib
.backanno
.end